# Altium schematic sheet Microphones.SchDoc
size A4
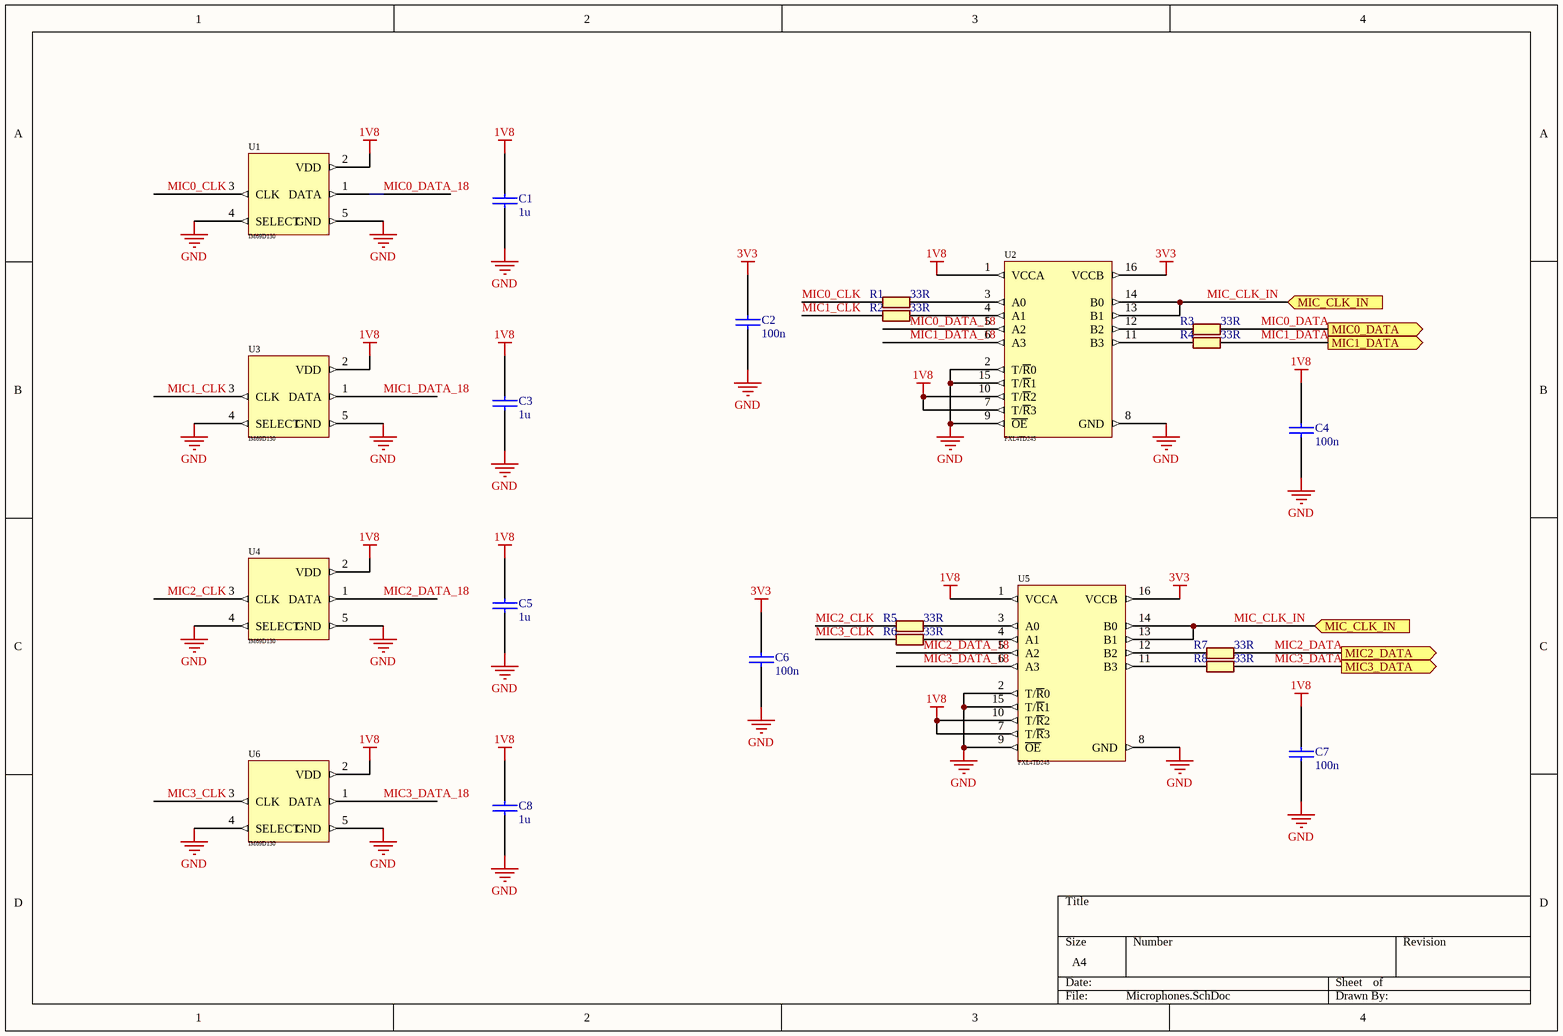
[diagram p0: Microphones.SchDoc]

## Parts
C1  1u  [C0603]
C2  100n  [C0603]
C3  1u  [C0603]
C4  100n  [C0603]
C5  1u  [C0603]
C6  100n  [C0603]
C7  100n  [C0603]
C8  1u  [C0603]
R1  33R  [R0603]
R2  33R  [R0603]
R3  33R  [R0603]
R4  33R  [R0603]
R5  33R  [R0603]
R6  33R  [R0603]
R7  33R  [R0603]
R8  33R  [R0603]
U1  IM69D130  [IM69D130 - duplicate]
U2  FXL4TD245  [DQFN16]
U3  IM69D130  [IM69D130 - duplicate]
U4  IM69D130  [IM69D130 - duplicate]
U5  FXL4TD245  [DQFN16]
U6  IM69D130  [IM69D130 - duplicate]

## Ports
MIC0_DATA (out), MIC1_DATA (out), MIC2_DATA (out), MIC3_DATA (out), MIC_CLK_IN (in)

## Nets
1V8: C1.1 C3.1 C4.1 C5.1 C7.1 C8.1 U1.2(VDD) U2.1(VCCA) U2.7(T/~{R}3) U2.10(T/~{R}2) U3.2(VDD) U4.2(VDD) U5.1(VCCA) U5.7(T/~{R}3) U5.10(T/~{R}2) U6.2(VDD)
3V3: C2.1 C6.1 U2.16(VCCB) U5.16(VCCB)
GND: C1.2 C2.2 C3.2 C4.2 C5.2 C6.2 C7.2 C8.2 U1.4(SELECT) U1.5(GND) U2.2(T/~{R}0) U2.8(GND) U2.9(~{OE}) U2.15(T/~{R}1) U3.4(SELECT) U3.5(GND) U4.4(SELECT) U4.5(GND) U5.2(T/~{R}0) U5.8(GND) U5.9(~{OE}) U5.15(T/~{R}1) U6.4(SELECT) U6.5(GND)
MIC0_CLK: R1.1 U1.3(CLK)
MIC0_DATA: R3.2 ; port MIC0_DATA
MIC0_DATA_18: U1.1(DATA) U2.5(A2)
MIC1_CLK: R2.1 U3.3(CLK)
MIC1_DATA: R4.2 ; port MIC1_DATA
MIC1_DATA_18: U2.6(A3) U3.1(DATA)
MIC2_CLK: R5.1 U4.3(CLK)
MIC2_DATA: R7.2 ; port MIC2_DATA
MIC2_DATA_18: U4.1(DATA) U5.5(A2)
MIC3_CLK: R6.1 U6.3(CLK)
MIC3_DATA: R8.2 ; port MIC3_DATA
MIC3_DATA_18: U5.6(A3) U6.1(DATA)
MIC_CLK_IN: U2.13(B1) U2.14(B0) U5.13(B1) U5.14(B0) ; port MIC_CLK_IN
NetR1_2: R1.2 U2.3(A0)
NetR2_2: R2.2 U2.4(A1)
NetR3_1: R3.1 U2.12(B2)
NetR4_1: R4.1 U2.11(B3)
NetR5_2: R5.2 U5.3(A0)
NetR6_2: R6.2 U5.4(A1)
NetR7_1: R7.1 U5.12(B2)
NetR8_1: R8.1 U5.11(B3)

## Library data of the parts
C1-C8 = CAP: Capacitor
R1-R8 = R: RES